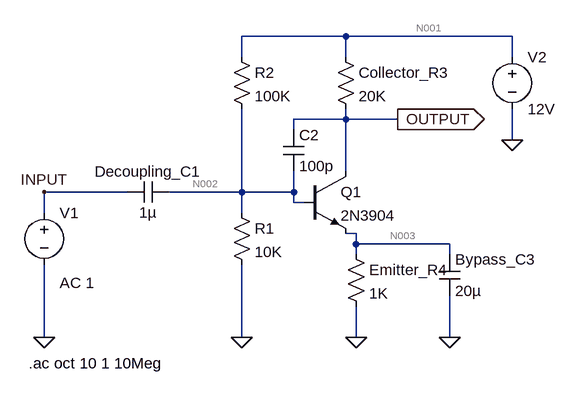
[diagram p0: schematic BJT_Amplifier.asc]
BJT_Amplifier.asc, the LTspice schematic file:
Version 4.1
SHEET 1 880 680
WIRE 544 -128 384 -128
WIRE 800 -128 544 -128
WIRE 384 -96 384 -128
WIRE 544 -96 544 -128
WIRE 800 -96 800 -128
WIRE 544 0 544 -16
WIRE 544 0 464 0
WIRE 624 0 544 0
WIRE 464 16 464 0
WIRE 800 32 800 -16
WIRE 544 80 544 0
WIRE 208 112 80 112
WIRE 384 112 384 -16
WIRE 384 112 272 112
WIRE 464 112 464 80
WIRE 464 112 384 112
WIRE 464 128 464 112
WIRE 480 128 464 128
WIRE 80 144 80 112
WIRE 384 144 384 112
WIRE 560 176 544 176
WIRE 560 192 560 176
WIRE 704 192 560 192
WIRE 560 208 560 192
WIRE 704 208 704 192
WIRE 80 336 80 224
WIRE 384 336 384 224
WIRE 560 336 560 288
WIRE 704 336 704 272
FLAG 80 336 0
FLAG 384 336 0
FLAG 560 336 0
FLAG 704 336 0
FLAG 800 32 0
FLAG 80 112 INPUT
FLAG 624 0 OUTPUT
IOPIN 624 0 Out
SYMBOL voltage 80 128 R0
WINDOW 123 24 124 Left 2
WINDOW 39 0 0 Left 0
SYMATTR InstName V1
SYMATTR Value ""
SYMATTR Value2 AC 1
SYMBOL cap 272 96 R90
WINDOW 0 0 32 VBottom 2
WINDOW 3 32 32 VTop 2
SYMATTR InstName Decoupling_C1
SYMATTR Value 1µ
SYMBOL res 368 128 R0
SYMATTR InstName R1
SYMATTR Value 10K
SYMBOL res 368 -112 R0
SYMATTR InstName R2
SYMATTR Value 100K
SYMBOL res 528 -112 R0
SYMATTR InstName Collector_R3
SYMATTR Value 20K
SYMBOL cap 448 16 R0
SYMATTR InstName C2
SYMATTR Value 100p
SYMBOL npn 480 80 R0
SYMATTR InstName Q1
SYMATTR Value 2N3904
SYMBOL res 544 192 R0
SYMATTR InstName Emitter_R4
SYMATTR Value 1K
SYMBOL cap 688 208 R0
SYMATTR InstName Bypass_C3
SYMATTR Value 20µ
SYMBOL voltage 800 -112 R0
WINDOW 123 0 0 Left 0
WINDOW 39 0 0 Left 0
SYMATTR InstName V2
SYMATTR Value 12V
TEXT 56 376 Left 2 !.ac oct 10 1 10Meg

The netlist it stands for:
* BJT_Amplifier.asc
V1 INPUT 0 AC 1
C§Decoupling_C1 N002 INPUT 1µ
R1 N002 0 10K
R2 N001 N002 100K
R§Collector_R3 N001 OUTPUT 20K
C2 OUTPUT N002 100p
Q1 OUTPUT N002 N003 0 2N3904
R§Emitter_R4 N003 0 1K
C§Bypass_C3 N003 0 20µ
V2 N001 0 12V
.model NPN NPN
.model PNP PNP
.lib standard.bjt
.ac oct 10 1 10Meg
.backanno
.end

* Results of the author's LTspice run, read from the files saved beside the schematic
* Operating Point, zero values left out:
*   V(n002) = 1.078 V
*   V(output) = 3.146 V
*   V(n003) = 444.1 mV
*   V(n001) = 12 V
*   I(Collector_R3) = 442.7 µA
*   I(Emitter_R4) = 444.1 µA
*   I(R1) = 107.8 µA
*   I(R2) = 109.2 µA
*   Ic(Q1) = 442.7 µA
*   Ib(Q1) = 1.447 µA
*   Ie(Q1) = -444.1 µA
*   I(V2) = -551.9 µA
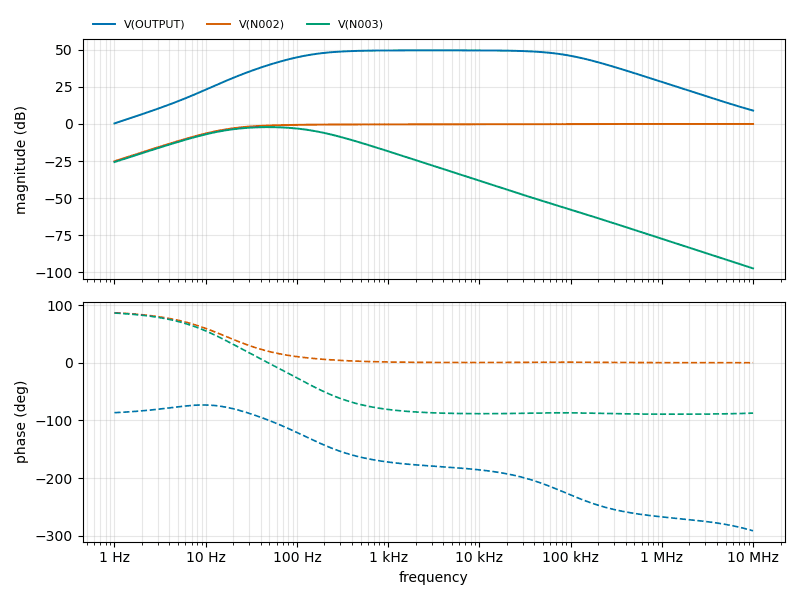
[diagram p1: AC Analysis of BJT_Amplifier.asc, plotted from the saved traces]
* AC Analysis, 1 run:
*   V(OUTPUT): 0.38 dB at 1 Hz, 9.02 dB at 10 MHz, peak 49.64 dB at 3.566 kHz, 3 dB below the peak at 139.2 Hz and 86.56 kHz
*   V(N002): -25.14 dB at 1 Hz, -0.00 dB at 10 MHz, peak -0.00 dB at 10 MHz, 3 dB below the peak at 19.47 Hz
*   V(N003): -25.68 dB at 1 Hz, -97.38 dB at 10 MHz, peak -2.12 dB at 48.5 Hz, 3 dB below the peak at 13.81 Hz and 168.7 Hz